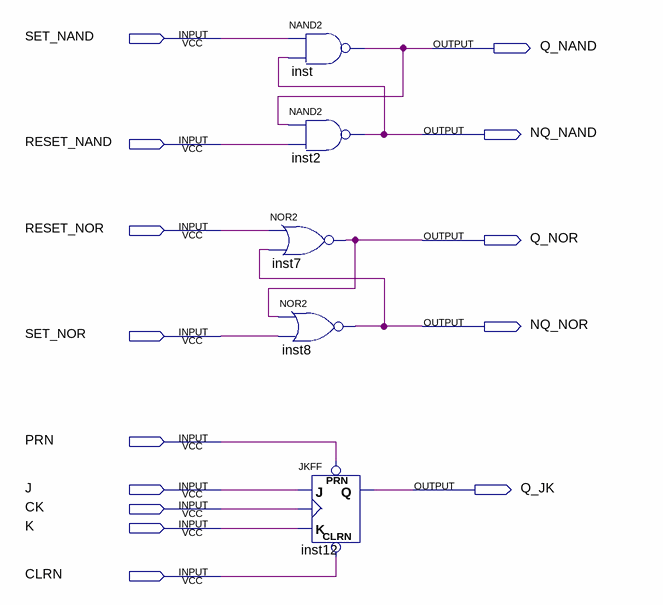
[diagram p0: schematic sheet]
// Quartus schematic exp6.bdf as structural Verilog: 5 symbols, 14 pins
module exp6 (
  input  SET_NAND,
  input  RESET_NAND,
  input  RESET_NOR,
  input  SET_NOR,
  input  PRN,
  input  J,
  input  CK,
  input  K,
  input  CLRN,
  output Q_NAND,
  output NQ_NAND,
  output Q_NOR,
  output NQ_NOR,
  output Q_JK
);

  nand inst (Q_NAND, SET_NAND, NQ_NAND);
  nand inst2 (NQ_NAND, Q_NAND, RESET_NAND);
  nor inst7 (Q_NOR, RESET_NOR, NQ_NOR);
  nor inst8 (NQ_NOR, Q_NOR, SET_NOR);
  JKFF inst12 (.PRN(PRN), .CLRN(CLRN), .K(K), .J(J), .CLK(CK), .Q(Q_JK));
endmodule
